# Altium schematic sheet Ethernet.SchDoc
size A4; SheetNumber: 7; SheetTotal: 11
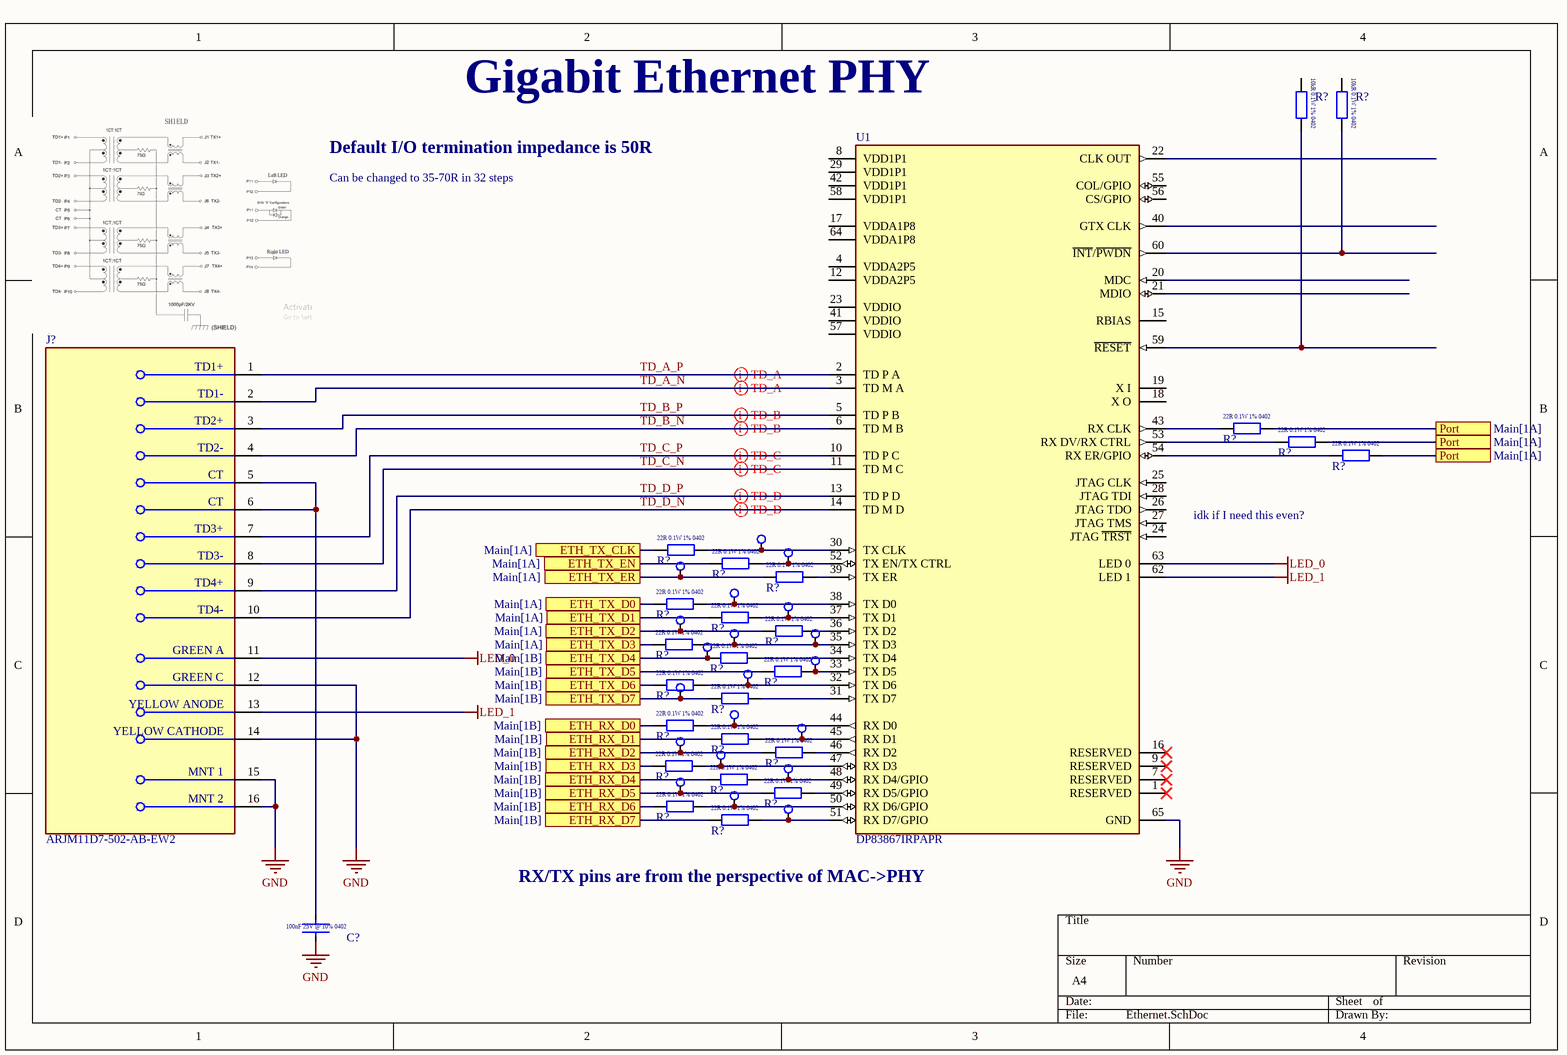
[diagram p0: Ethernet.SchDoc]

## Parts
(Parts that share a designator on the sheet are numbered #1, #2 ... from top to bottom, then left to right.)
C?  CL05A104KA5NNNC  [CAPC1005X06N]  (value not drawn)
J?  ARJM11D7-502-AB-EW2  [FP-ARJM11D7-502-AB-EW2-MFG]
R?#1  RK73H1ETTP1002F  [RESC1005X04N]  (value not drawn)
R?#2  RK73H1ETTP1002F  [RESC1005X04N]  (value not drawn)
R?#3  RK73H1ETTP22R0F  [RESC1005X04N]  (value not drawn)
R?#4  RK73H1ETTP22R0F  [RESC1005X04N]  (value not drawn)
R?#5  RK73H1ETTP22R0F  [RESC1005X04N]  (value not drawn)
R?#6  RK73H1ETTP22R0F  [RESC1005X04N]  (value not drawn)
R?#7  RK73H1ETTP22R0F  [RESC1005X04N]  (value not drawn)
R?#8  RK73H1ETTP22R0F  [RESC1005X04N]  (value not drawn)
R?#9  RK73H1ETTP22R0F  [RESC1005X04N]  (value not drawn)
R?#10  RK73H1ETTP22R0F  [RESC1005X04N]  (value not drawn)
R?#11  RK73H1ETTP22R0F  [RESC1005X04N]  (value not drawn)
R?#12  RK73H1ETTP22R0F  [RESC1005X04N]  (value not drawn)
R?#13  RK73H1ETTP22R0F  [RESC1005X04N]  (value not drawn)
R?#14  RK73H1ETTP22R0F  [RESC1005X04N]  (value not drawn)
R?#15  RK73H1ETTP22R0F  [RESC1005X04N]  (value not drawn)
R?#16  RK73H1ETTP22R0F  [RESC1005X04N]  (value not drawn)
R?#17  RK73H1ETTP22R0F  [RESC1005X04N]  (value not drawn)
R?#18  RK73H1ETTP22R0F  [RESC1005X04N]  (value not drawn)
R?#19  RK73H1ETTP22R0F  [RESC1005X04N]  (value not drawn)
R?#20  RK73H1ETTP22R0F  [RESC1005X04N]  (value not drawn)
R?#21  RK73H1ETTP22R0F  [RESC1005X04N]  (value not drawn)
R?#22  RK73H1ETTP22R0F  [RESC1005X04N]  (value not drawn)
R?#23  RK73H1ETTP22R0F  [RESC1005X04N]  (value not drawn)
R?#24  RK73H1ETTP22R0F  [RESC1005X04N]  (value not drawn)
TP1  Test Point  [Test Point]  (value not drawn)
TP2  Test Point  [Test Point]  (value not drawn)
TP3  Test Point  [Test Point]  (value not drawn)
TP4  Test Point  [Test Point]  (value not drawn)
TP5#1  Test Point  [Test Point]  (value not drawn)
TP5#2  Test Point  [Test Point]  (value not drawn)
TP7  Test Point  [Test Point]  (value not drawn)
TP8  Test Point  [Test Point]  (value not drawn)
TP9  Test Point  [Test Point]  (value not drawn)
TP10  Test Point  [Test Point]  (value not drawn)
TP11  Test Point  [Test Point]  (value not drawn)
TP?#1  Test Point  [Test Point]  (value not drawn)
TP?#2  Test Point  [Test Point]  (value not drawn)
TP?#3  Test Point  [Test Point]  (value not drawn)
TP?#4  Test Point  [Test Point]  (value not drawn)
TP?#5  Test Point  [Test Point]  (value not drawn)
TP?#6  Test Point  [Test Point]  (value not drawn)
TP?#7  Test Point  [Test Point]  (value not drawn)
TP?#8  Test Point  [Test Point]  (value not drawn)
TP?#9  Test Point  [Test Point]  (value not drawn)
U1  DP83867IRPAPR  [FP-PAP0064M-MFG]

## Ports
ETH_RX_D0 (see Main[1B]), ETH_RX_D1 (see Main[1B]), ETH_RX_D2 (see Main[1B]), ETH_RX_D3 (see Main[1B]), ETH_RX_D4 (see Main[1B]), ETH_RX_D5 (see Main[1B]), ETH_RX_D6 (see Main[1B]), ETH_RX_D7 (see Main[1B]), ETH_TX_CLK (see Main[1A]), ETH_TX_D0 (see Main[1A]), ETH_TX_D1 (see Main[1A]), ETH_TX_D2 (see Main[1A]), ETH_TX_D3 (see Main[1A]), ETH_TX_D4 (see Main[1B]), ETH_TX_D5 (see Main[1B]), ETH_TX_D6 (see Main[1B]), ETH_TX_D7 (see Main[1B]), ETH_TX_EN (see Main[1A]), ETH_TX_ER (see Main[1A]), Port (see Main[1A])

## Nets
GND: C?.1 J?.12(GREEN_C) J?.14(YELLOW_CATHODE) J?.15(MNT_1) J?.16(MNT_2) U1.65(GND)
LED_0: J?.11(GREEN_A) U1.63(LED_0)
LED_1: J?.13(YELLOW_ANODE) U1.62(LED_1)
ETH_RX_D0: R?#17.1 ; port ETH_RX_D0
ETH_RX_D1: R?#18.1 ; port ETH_RX_D1
ETH_RX_D2: R?#19.1 TP?#4.12 ; port ETH_RX_D2
ETH_RX_D3: R?#20.1 ; port ETH_RX_D3
ETH_RX_D4: R?#21.1 ; port ETH_RX_D4
ETH_RX_D5: R?#22.1 TP?#7.12 ; port ETH_RX_D5
ETH_RX_D6: R?#23.1 ; port ETH_RX_D6
ETH_RX_D7: R?#24.1 ; port ETH_RX_D7
ETH_TX_CLK: R?#6.1 ; port ETH_TX_CLK
ETH_TX_D0: R?#9.1 ; port ETH_TX_D0
ETH_TX_D1: R?#10.1 ; port ETH_TX_D1
ETH_TX_D2: R?#11.1 TP5#2.12 ; port ETH_TX_D2
ETH_TX_D3: R?#12.1 ; port ETH_TX_D3
ETH_TX_D4: R?#13.1 TP8.12 ; port ETH_TX_D4
ETH_TX_D5: R?#14.1 ; port ETH_TX_D5
ETH_TX_D6: R?#15.1 ; port ETH_TX_D6
ETH_TX_D7: R?#16.1 TP11.12 ; port ETH_TX_D7
ETH_TX_EN: R?#7.1 ; port ETH_TX_EN
ETH_TX_ER: R?#8.1 TP3.12 ; port ETH_TX_ER
Port: R?#3.2 R?#4.2 R?#5.2 ; port Port
TD_A_N: J?.2(TD1-) U1.3(TD_M_A)
TD_A_P: J?.1(TD1+) U1.2(TD_P_A)
TD_B_N: J?.4(TD2-) U1.6(TD_M_B)
TD_B_P: J?.3(TD2+) U1.5(TD_P_B)
TD_C_N: J?.8(TD3-) U1.11(TD_M_C)
TD_C_P: J?.7(TD3+) U1.10(TD_P_C)
TD_D_N: J?.10(TD4-) U1.14(TD_M_D)
TD_D_P: J?.9(TD4+) U1.13(TD_P_D)
NetC?_2: C?.2 J?.5(CT) J?.6(CT)
NetR?#1_2: R?#1.2 U1.59(~{RESET})
NetR?#2_2: R?#2.2 U1.60(~{INT}/~{PWDN})
NetR?#3_1: R?#3.1 U1.43(RX_CLK)
NetR?#4_1: R?#4.1 U1.53(RX_DV/RX_CTRL)
NetR?#5_1: R?#5.1 U1.54(RX_ER/GPIO)
NetR?#6_2: R?#6.2 TP1.12 U1.30(TX_CLK)
NetR?#7_2: R?#7.2 TP2.12 U1.52(TX_EN/TX_CTRL)
NetR?#8_2: R?#8.2 U1.39(TX_ER)
NetR?#9_2: R?#9.2 TP4.12 U1.38(TX_D0)
NetR?#10_2: R?#10.2 TP5#1.12 U1.37(TX_D1)
NetR?#11_2: R?#11.2 U1.36(TX_D2)
NetR?#12_2: R?#12.2 TP7.12 TP?#1.12 U1.35(TX_D3)
NetR?#13_2: R?#13.2 U1.34(TX_D4)
NetR?#14_2: R?#14.2 TP9.12 U1.33(TX_D5)
NetR?#15_2: R?#15.2 TP10.12 U1.32(TX_D6)
NetR?#16_2: R?#16.2 U1.31(TX_D7)
NetR?#17_2: R?#17.2 TP?#2.12 U1.44(RX_D0)
NetR?#18_2: R?#18.2 TP?#3.12 U1.45(RX_D1)
NetR?#19_2: R?#19.2 U1.46(RX_D2)
NetR?#20_2: R?#20.2 TP?#5.12 U1.47(RX_D3)
NetR?#21_2: R?#21.2 TP?#6.12 U1.48(RX_D4/GPIO)
NetR?#22_2: R?#22.2 U1.49(RX_D5/GPIO)
NetR?#23_2: R?#23.2 TP?#8.12 U1.50(RX_D6/GPIO)
NetR?#24_2: R?#24.2 TP?#9.12 U1.51(RX_D7/GPIO)

Not connected (* = marked no-connect by the designer): R?#1 1; R?#2 1; U1 1(RESERVED)* 4(VDDA2P5) 7(RESERVED)* 8(VDD1P1) 9(RESERVED)* 12(VDDA2P5) 15(RBIAS) 16(RESERVED)* 17(VDDA1P8) 18(X_O) 19(X_I) 20(MDC) 21(MDIO) 22(CLK_OUT) 23(VDDIO) 24(JTAG_~{TRST}) 25(JTAG_CLK) 26(JTAG_TDO) 27(JTAG_TMS) 28(JTAG_TDI) 29(VDD1P1) 40(GTX_CLK) 41(VDDIO) 42(VDD1P1) 55(COL/GPIO) 56(CS/GPIO) 57(VDDIO) 58(VDD1P1) 64(VDDA1P8)

## Layout directives
differential pair: TD_A_N, TD_A_P, TD_B_N, TD_B_P, TD_C_N, TD_C_P, TD_D_N, TD_D_P

## Notes on the sheet
- Gigabit Ethernet PHY
- Default I/O termination impedance is 50R
- Can be changed to 35-70R in 32 steps
- idk if I need this even?
- RX/TX pins are from the perspective of MAC->PHY
- (in symbol CL05A104KA5NNNC) 100nF 25V @ 10% 0402
- (in symbol RK73H1ETTP22R0F) 22R 0.1W 1% 0402
- (in symbol RK73H1ETTP1002F) 10kR 0.1W 1% 0402

## Library data of the parts
C? = CL05A104KA5NNNC: 0.1 µF ±10% 25V Ceramic Capacitor X5R 0402 (1005 Metric)
J? = CMP-27893-000003-1: CONN JACK 1PORT 1000 BASE-T PCB; Number of Ports: 1; Connector Type: RJ45; Shielding: Shielded; Direction: Up; Number of Cores per Jack: 8; Max Operating Temperature: 85°C; Min Operating Temperature: -40°C; Contact Plating: Gold; RoHS Compliant: Yes; Termination: Solder; Mount: Through Hole; Color: Green; Number of Rows: 1; Packaging: Tray
R?#1 R?#2 = RK73H1ETTP1002F: 10 kOhms ±1% 0.1W, 1/10W Chip Resistor 0402 (1005 Metric) Automotive AEC-Q200 Thick Film
R?#3-R?#24 = RK73H1ETTP22R0F: 22 Ohms ±1% 0.1W, 1/10W Chip Resistor 0402 (1005 Metric) Automotive AEC-Q200 Thick Film
U1 = CMP-04874-000030-1: IC ETHERNET PHY 64HTQFP; Operating Supply Current: 157mA; Cable Length: 130m; Interface: Serial; Max Operating Temperature: 85°C; RoHS Compliant: Yes; Lead Free: Lead Free; Min Operating Temperature: -40°C; Packaging: Tape and Reel